# Altium schematic sheet WiFi&4G_F.SchDoc
size A4
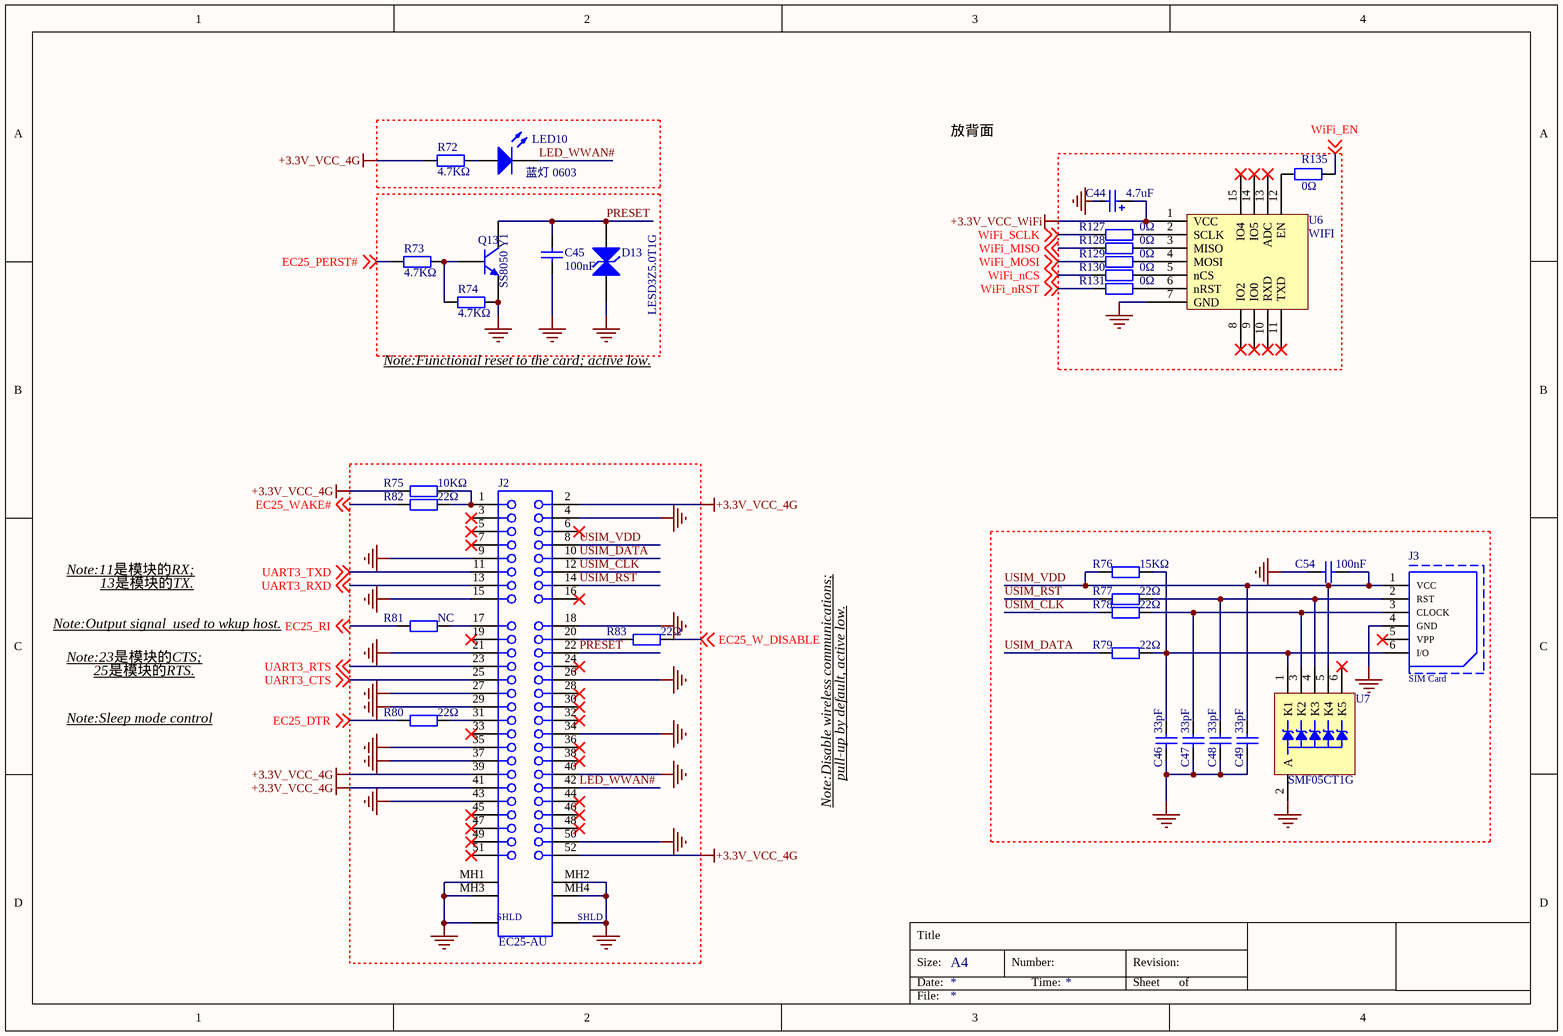
[diagram p0: WiFi&4G_F.SchDoc]

## Parts
C44  4.7uF  [CASE-A_3216]
C45  100nF  [0603_C]
C46  33pF  [0402_C]
C47  33pF  [0402_C]
C48  33pF  [0402_C]
C49  33pF  [0402_C]
C54  100nF  [0402_C]
D13  LESD3Z5.0T1G  [SOD-323]
J2  EC25-AU  [PCIEmin-i]
J3  SIM Card  [SIM Card]
LED10  蓝灯 0603  [0603_LED_S1]
Q13  SS8050 Y1  [SOT-23(SOT-23-3)]
R72  4.7KΩ  [0603_R]
R73  4.7KΩ  [0603_R]
R74  4.7KΩ  [0603_R]
R75  10KΩ  [0402_R]
R76  15KΩ  [0402_R]
R77  22Ω  [0402_R]
R78  22Ω  [0402_R]
R79  22Ω  [0402_R]
R80  22Ω  [0402_R]
R81  NC  [0402_R]
R82  22Ω  [0402_R]
R83  22Ω  [0402_R]
R127  0Ω  [0402_R]
R128  0Ω  [0402_R]
R129  0Ω  [0402_R]
R130  0Ω  [0402_R]
R131  0Ω  [0402_R]
R135  0Ω  [0402_R]
U6  WIFI  [MT8266WIFI-H]
U7  SMF05CT1G  [SC-70-6(SOT-363)]

## Nets
+3.3V_VCC_4G: J2.2 J2.39 J2.41 J2.52 R72.2 R75.1
+3.3V_VCC_WiFi: C44.1 U6.1(VCC)
GND: C44.2 C45.1 C46.1 C47.1 C48.1 C49.1 C54.1 D13.1(A) J2.4 J2.9 J2.15 J2.18 J2.21 J2.26 J2.27 J2.29 J2.34 J2.35 J2.37 J2.40 J2.43 J2.50 J2.53(SHLD) J2.54(SHLD) J2.MH1 J2.MH2 J2.MH3 J2.MH4 J3.4(GND) Q13.2(E) R74.2 U6.7(GND) U7.2(A)
EC25_DTR: R80.1 ; off-sheet EC25_DTR
EC25_PERST#: R73.1 ; off-sheet EC25_PERST#
EC25_RI: R81.1 ; off-sheet EC25_RI
EC25_W_DISABLE: R83.2 ; off-sheet EC25_W_DISABLE
EC25_WAKE#: R82.1 ; off-sheet EC25_WAKE#
LED_WWAN#: J2.42 LED10.K
PRESET: C45.2 D13.2(K) J2.22 Q13.3(C)
UART3_CTS: J2.25 ; off-sheet UART3_CTS
UART3_RTS: J2.23 ; off-sheet UART3_RTS
UART3_RXD: J2.13 ; off-sheet UART3_RXD
UART3_TXD: J2.11 ; off-sheet UART3_TXD
USIM_CLK: J2.12 R78.1
USIM_DATA: J2.10 R79.1
USIM_RST: J2.14 R77.1
USIM_VDD: C49.2 C54.2 J2.8 J3.1(VCC) R76.2 U7.5(K4)
WiFi_EN: R135.2 ; off-sheet WiFi_EN
WiFi_MISO: R128.1 ; off-sheet WiFi_MISO
WiFi_MOSI: R129.1 ; off-sheet WiFi_MOSI
WiFi_nCS: R130.1 ; off-sheet WiFi_nCS
WiFi_nRST: R131.1 ; off-sheet WiFi_nRST
WiFi_SCLK: R127.1 ; off-sheet WiFi_SCLK
NetC46_2: C46.2 J3.6(I/O) R76.1 R79.2 U7.1(K1)
NetC47_2: C47.2 J3.3(CLOCK) R78.2 U7.3(K2)
NetC48_2: C48.2 J3.2(RST) R77.2 U7.4(K3)
NetJ2_1: J2.1 R75.2 R82.2
NetJ2_17: J2.17 R81.2
NetJ2_20: J2.20 R83.1
NetJ2_31: J2.31 R80.2
NetLED10_A: LED10.A R72.1
NetQ13_1: Q13.1(B) R73.2 R74.1
NetR127_2: R127.2 U6.2(SCLK)
NetR128_2: R128.2 U6.3(MISO)
NetR129_2: R129.2 U6.4(MOSI)
NetR130_2: R130.2 U6.5(nCS)
NetR131_2: R131.2 U6.6(nRST)
NetR135_1: R135.1 U6.12(EN)

Not connected (* = marked no-connect by the designer): J2 3* 5* 6* 7* 16* 19* 24* 28* 30* 32* 33* 36* 38* 44* 45* 46* 47* 48* 49* 51*; J3 5(VPP)*; U6 8(IO2)* 9(IO0)* 10(RXD)* 11(TXD)* 13(ADC)* 14(IO5)* 15(IO4)*; U7 6(K5)*

## Notes on the sheet
- 放背面
- Note:Functional reset to the card; active low.
- Note:11是模块的RX;
- Note:Output signal  used to wkup host.
- 13是模块的TX.
- Note:23是模块的CTS;
- 25是模块的RTS.
- Note:Sleep mode control
- pull-up by default, active low.
- Note:Disable wireless communications;
- Title
- Size:
- Date:
- A4
- Number:
- Time:
- Revision:
- Sheet
- of
- File:
- *

## Library data of the parts
C44 = 3216 10uF (106) 10% 16V: 钽电容; ComponentLink1Description: 供应商链接; ComponentLink1URL: http://www.szlcsc.com/product/details_7643.html; Package: 3216; Supplier: LC; SuppliersPartNumber: C7171
C45 = Cap 0603 100nF (104) 10% 50V: 贴片电容; ComponentLink1Description: 供应商链接; ComponentLink1URL: http://www.szlcsc.com/product/details_15331.html; Package: 0603; Supplier: LC; SuppliersPartNumber: C14663
C46-C49 = Cap 0402 33pF (330) 5% 50V: 贴片电容; ComponentLink1Description: 供应商链接; ComponentLink1URL: http://www.szlcsc.com/product/details_1914.html; Package: 0402; Supplier: LC; SuppliersPartNumber: C1562
C54 = Cap 0402 100nF (104) 10% 16V: 贴片电容; ComponentLink1Description: 供应商链接; ComponentLink1URL: http://www.szlcsc.com/product/details_1877.html; Package: 0402; Supplier: LC; SuppliersPartNumber: C1525
D13 = SOD-323 LESD3Z5.0T1G: TVS/ESD, SOD-323, 5V; ComponentLink1Description: 供应商链接; ComponentLink1URL: http://www.szlcsc.com/product/details_79530.html; Package: SMB/DO-214AA; Supplier: LC; SuppliersPartNumber: C78395
J2 = PCIE-Mini: Female Header, Pitch 0.8 mm, 2 x 26 Position, Height 9.9 mm, -40 to 85 degC, RoHS, Tape and Reel, CMP-2000-05614-1, 48338-0099; Brand: Molex; Number of Positions / Contacts: 52; Mounting Angle: Right; Housing Material: Thermoplastic; Mounting Style: SMD/SMT; Series: 48338; Contact Plating: Gold; Product Category: PCIExpress/PCIConnectors; Factory Pack Quantity: 300; Manufacturer: Molex; Package Description: 52-Pin Surface Mount Device, Body 30 x 9.3 mm, Pitch 0.8 mm; Datasheet Version: Rev. F, 06/2009; Mounting Technology: SurfaceMount; Packaging: Reel; Product Type: MiniPCI; Package Reference: 48338-0099; Manufacturer URL: http://www.molex.com/; Contact Material: CopperAlloy; Datasheet URL: http://www.molex.com/pdm_docs/sd/483380099_sd.pdf; Number of Positions: 52; RoHS: Details
J3 = SIM Card MUP: MUP, 6P; Manufacturer: Wurth Elektronik; Part Number: 693010020611; Working Voltage: 50VAC; Rated Current: 0.5A; Withstanding Voltage: 500VAC; Packaging: TapeandReel; Manufacturer URL: http://www.we-online.de; Operating Temperature: -25to85degC; Publisher: WurthElektronik; Package Reference: 693010020611; Datasheet URL: https://katalog.we-online.de/em/datasheet/693010020611.pdf; Mounting Technology: SMT; Taobao: https://item.taobao.com/item.htm?spm=a230r.1.14.37.7dfabe7eHV2uMn&id=550214241835&ns=1&abbucket=6#detail
LED10 = LED 0603 蓝灯: 发光二极管; ComponentLink1Description: 供应商链接; ComponentLink1URL: http://www.szlcsc.com/product/details_73150.html; Package: 0603; Supplier: LC; SuppliersPartNumber: C72041
Q13 = SOT-23 SS8050 Y1: 三极管; ComponentLink1Description: 供应商链接; ComponentLink1URL: http://www.szlcsc.com/product/details_2507.html; Package: SOT-23; Supplier: LC; SuppliersPartNumber: C2150
R72-R74 = Res 0603 4.7KΩ (4701) 1%: 贴片电阻; ComponentLink1Description: 供应商链接; ComponentLink1URL: http://www.szlcsc.com/product/details_23889.html; Package: 0603; Supplier: LC; SuppliersPartNumber: C23162
R75 = Res 0402 10KΩ (1002) 1%: 贴片电阻; ComponentLink1Description: 供应商链接; ComponentLink1URL: http://www.szlcsc.com/product/details_26487.html; Package: 0402; Supplier: LC; SuppliersPartNumber: C25744; Value: 10KΩ
R76 = Res 0402 15KΩ (1502) 1%: 贴片电阻; ComponentLink1Description: 供应商链接; ComponentLink1URL: http://www.szlcsc.com/product/details_26499.html; Package: 0402; Supplier: LC; SuppliersPartNumber: C25756
R77-R80 R82 R83 = Res 0402 22Ω (22R0) 1%: 贴片电阻; ComponentLink1Description: 供应商链接; ComponentLink1URL: http://www.szlcsc.com/product/details_25835.html; Package: 0402; Supplier: LC; SuppliersPartNumber: C25092; Value: 22Ω
R81 = Res 0402 22Ω (22R0) 1%: 贴片电阻; Value: 22Ω; ComponentLink1Description: 供应商链接; ComponentLink1URL: http://www.szlcsc.com/product/details_25835.html; Package: 0402; Supplier: LC; SuppliersPartNumber: C25092
R127-R131 R135 = Res 0402 0Ω (0R0) 1%: 贴片电阻; ComponentLink1Description: 供应商链接; ComponentLink1URL: http://www.szlcsc.com/product/details_17853.html; Package: 0402; Supplier: LC; SuppliersPartNumber: C17168; Value: 0Ω
U6 = MT8266WIFI
U7 = SMF05CT1G_[C15879]_i: TVS; ComponentLink1Description: 供应商链接; ComponentLink1URL: http://www.szlcsc.com/product/details_16561.html; Package: SC-70-6(SOT-363); Supplier: LC; SuppliersPartNumber: C15879